# EAGLE design User_Interface_5 (EAGLE 9.2.1)
Daughter board for User Interface
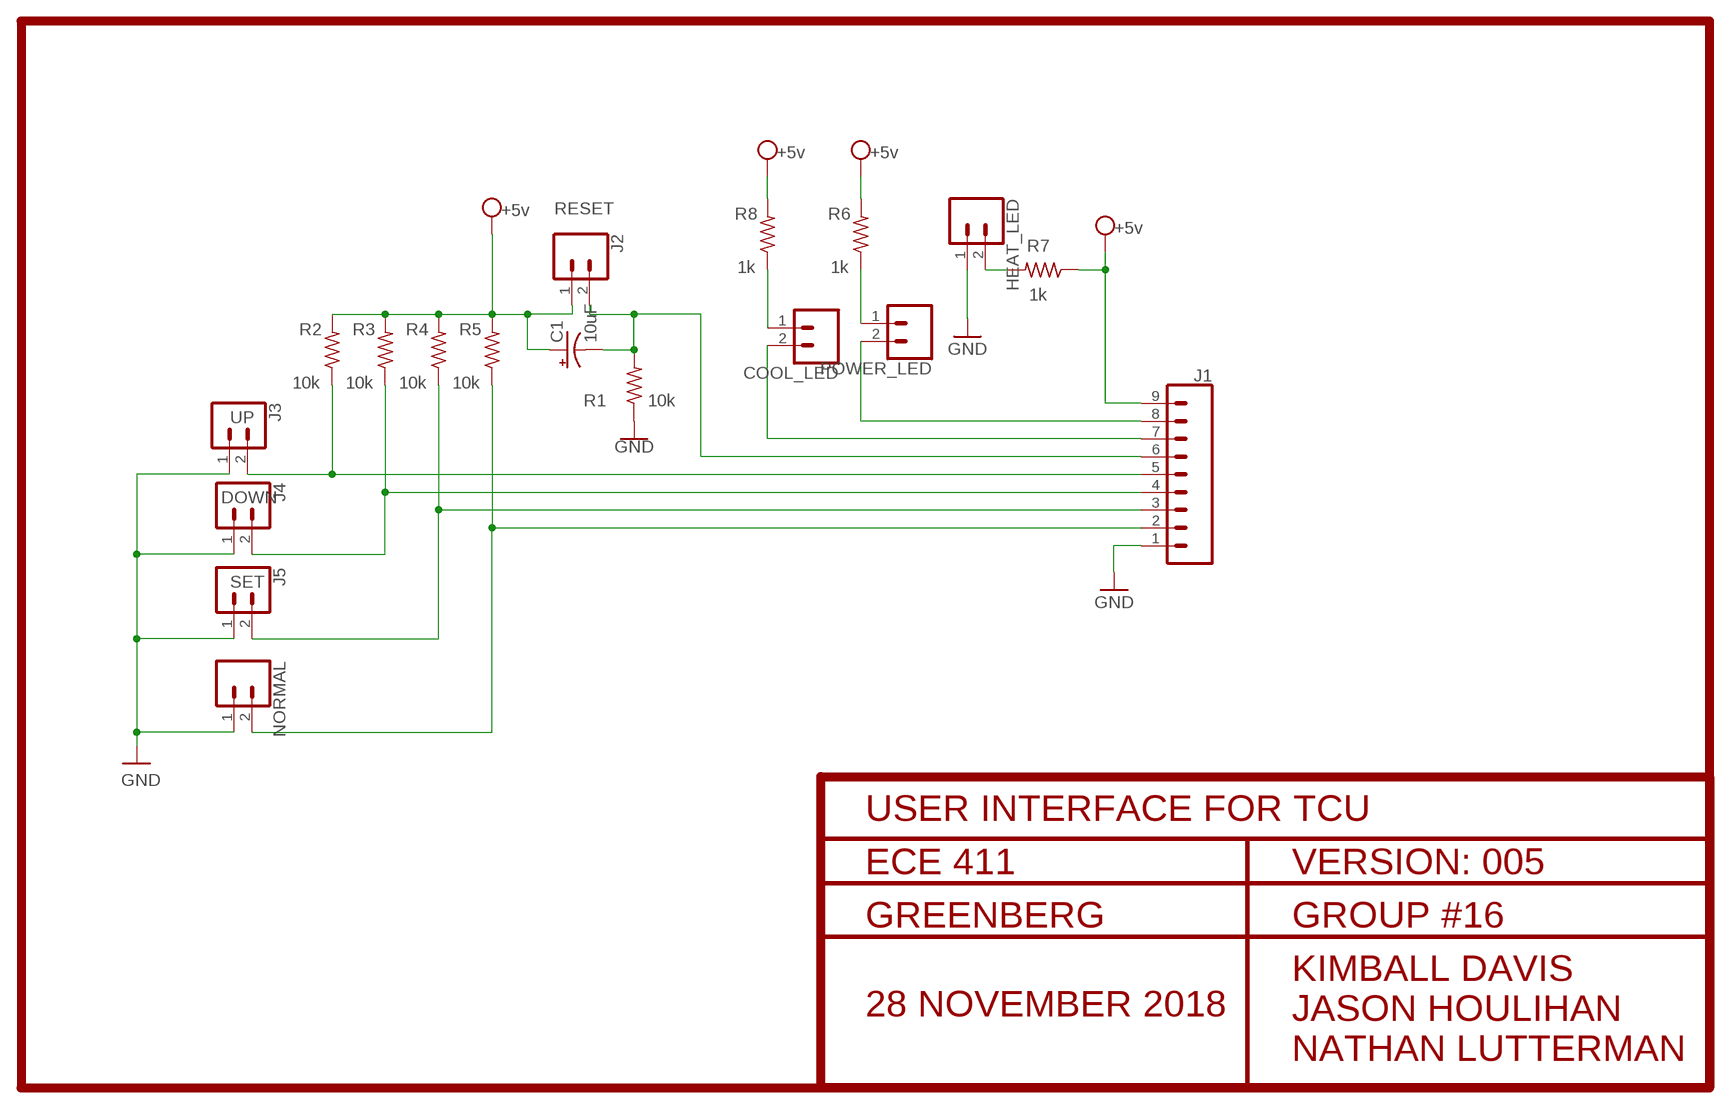
[diagram p0: schematic, sheet 1]

## Parts
C1  10uF  10UF-POLAR-RADIAL-2.5MM-25V-20%  [CPOL-RADIAL-2.5MM-5MM]
COOL_LED  CONN_02  [1X02]
HEAT_LED  CONN_02  [1X02]
J1  CONN_09  [1X09]
J2  RESET  CONN_02  [1X02]
J3  UP  CONN_02  [1X02]
J4  DOWN  CONN_02  [1X02]
J5  SET  CONN_02  [1X02]
NORMAL  CONN_02  [1X02]
POWER_LED  CONN_02  [1X02]
R1  10k  R-US_R0603  [R0603]
R2  10k  R-US_R0603  [R0603]
R3  10k  R-US_R0603  [R0603]
R4  10k  R-US_R0603  [R0603]
R5  10k  R-US_R0603  [R0603]
R6  1k  R-US_R0603  [R0603]
R7  1k  R-US_R0603  [R0603]
R8  1k  R-US_R0603  [R0603]

## Nets
GND: HEAT_LED.1 J1.1 J3.1 J4.1 J5.1 NORMAL.1 R1.1
N$1: COOL_LED.1 R8.1
N$2: J1.8 POWER_LED.2
N$3: COOL_LED.2 J1.7
N$4: J1.5 J3.2 R2.1
N$5: J1.4 J4.2 R3.1
N$6: J1.3 J5.2 R4.1
N$7: J1.2 NORMAL.2 R5.1
N$8: POWER_LED.1 R6.1
N$9: HEAT_LED.2 R7.2
RST: C1.2(-) J1.6 J2.2 R1.2
VCC: C1.1(+) J1.9 J2.1 R2.2 R3.2 R4.2 R5.2 R6.2 R7.1 R8.2 ; supply symbol labelled +5v

## Library data of the parts
C1 = SparkFun-Capacitors:10UF-POLAR: 10.0µF polarized capacitors A capacitor is a passive two-terminal electrical component used to store electrical energy temporarily in an electric field.; PROD_ID: CAP-08440
COOL_LED HEAT_LED J2-J5 NORMAL POWER_LED = SparkFun-Connectors:CONN_02: Multi connection point. Often used as Generic Header-pin footprint for 0.1 inch spaced/style header connections On any of the 0.1 inch spaced packages, you can populate with these: Break Away Headers - Straight <https://www.sparkfun.com/products/116> (PRT-00116) Break Away Male Headers - Right Angle <https://www.sparkfun.com/products/553> (PRT-00553) Female Headers <https://www.sparkfun.com/products/115> (PRT-00115) Break Away Headers - Machine Pin <https://www.sparkfun.com/products/117> (PRT-00117) Break Away Female Headers - Swiss Machine Pin <https://www.sparkfun.com/products/743> (PRT-00743) For SCREWTERMINALS and SPRING TERMINALS visit here: Screw Terimnals on SparkFun.com <https://www.sparkfun.com/search/results?term=Screw+Terminals> (5mm/3.5mm/2.54mm spacing) This device is also useful as a general connection point to wire up your design to another part of your project. Our various solder wires solder well into these plated through hole pads. Hook-Up Wire - Assortment (Stranded, 22 AWG) <https://www.sparkfun.com/products/11375> (PRT-11375) Hook-Up Wire - Assortment (Solid Core, 22 AWG) <https://www.sparkfun.com/products/11367> (PRT-11367) View the entire wire category on our website here <https://www.sparkfun.com/categories/141> Special notes: Molex polarized connector foot print use with: PRT-08233 with associated crimp pins and housings. 2.54_SCREWTERM for use with PRT-10571. 3.5mm Screw Terminal footprints for PRT-08084 5mm Screw Terminal footprints for use with PRT-08432
J1 = SparkFun-Connectors:CONN_09: Multi connection point. Often used as Generic Header-pin footprint for 0.1 inch spaced/style header connections On any of the 0.1 inch spaced packages, you can populate with these: Break Away Headers - Straight <https://www.sparkfun.com/products/116> (PRT-00116) Break Away Male Headers - Right Angle <https://www.sparkfun.com/products/553> (PRT-00553) Female Headers <https://www.sparkfun.com/products/115> (PRT-00115) Break Away Headers - Machine Pin <https://www.sparkfun.com/products/117> (PRT-00117) Break Away Female Headers - Swiss Machine Pin <https://www.sparkfun.com/products/743> (PRT-00743) For SCREWTERMINALS and SPRING TERMINALS visit here: Screw Terimnals on SparkFun.com <https://www.sparkfun.com/search/results?term=Screw+Terminals> (5mm/3.5mm/2.54mm spacing) This device is also useful as a general connection point to wire up your design to another part of your project. Our various solder wires solder well into these plated through hole pads. Hook-Up Wire - Assortment (Stranded, 22 AWG) <https://www.sparkfun.com/products/11375> (PRT-11375) Hook-Up Wire - Assortment (Solid Core, 22 AWG) <https://www.sparkfun.com/products/11367> (PRT-11367) View the entire wire category on our website here <https://www.sparkfun.com/categories/141> Special notes: Molex polarized connector foot print use with SKU : PRT-08231 with associated crimp pins and housings. 1MM SMD Version SKU: PRT-10208 NOTES ON THE VARIANTS LOCK and LOCK_LONGPADS... This footprint was designed to help hold the alignment of a through-hole component (i.e. 6-pin header) while soldering it into place. You may notice that each hole has been shifted either up or down by 0.005 of an inch from it's more standard position (which is a perfectly straight line). This slight alteration caused the pins (the squares in the middle) to touch the edges of the holes. Because they are alternating, it causes a "brace" to hold the component in place. 0.005 has proven to be the perfect amount of "off-center" position when using our standard breakaway headers. Although looks a little odd when you look at the bare footprint, once you have a header in there, the alteration is very hard to notice. Also,if you push a header all the way into place, it is covered up entirely on the bottom side.
R1-R8 = audio amplifier example:R-US_: RESISTOR, American symbol

## Board
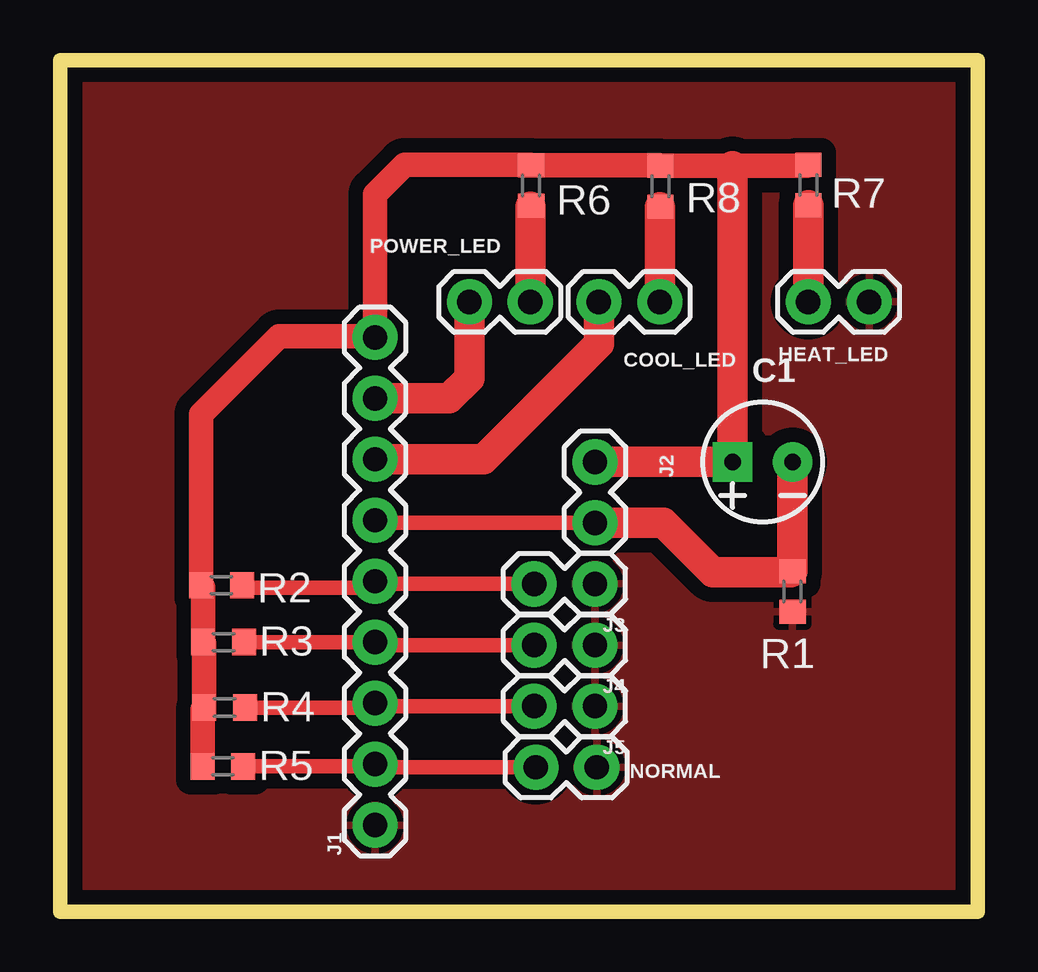
[diagram p1: board, top side]

Size 38.26 x 35.48 mm. Coordinates in mm from the lower left corner, seen from the top.
Outline: 0,35.48 0,0 38.26,0 38.26,35.48 0,35.48
Copper layers (1*16): Top 0.0178mm / dielectric 59mil / Bottom 0.0178mm
Design rules "EPL": minimum track width 8mil, minimum drill 0.35mm, track to track 8mil, track to pad 8mil, pad to pad 8mil, via to via 8mil, smd to smd 8mil, copper to edge 15mil, drill to drill 15mil, minimum pad ring 8mil, minimum via ring 8mil, stop-mask expansion 3mil, vias tented up to drill 0mil, thermal gap 10mil

### Footprints (pad centres in the part's own frame; a part is rotated, then mirrored left to right if it is on the bottom)
CPOL-RADIAL-2.5MM-5MM = drill 0.7 pad 1.651 square: 1 1.25,0 | drill 0.7 pad 1.651: 2 -1.25,0
1X02 = drill 1.016 pad 1.88: 1 0,0; 2 2.54,0
1X09 = drill 1.016 pad 1.88: 1 0,0; 2 2.54,0; 3 5.08,0; 4 7.62,0; 5 10.16,0; 6 12.7,0; 7 15.24,0; 8 17.78,0; 9 20.32,0
R0603 = smd 1 x 1.1: 1 -0.85,0; 2 0.85,0

### Placement (x,y rotation side)
C1  29.29,18.73 180 top
COOL_LED  25,25.4 180 top
HEAT_LED  33.73,25.4 180 top
J1  13.13,3.6 90 top
J2  22.3,18.73 270 top
J3  22.3,13.65 180 top
J4  22.3,11.1 180 top
J5  22.3,8.56 180 top
NORMAL  22.38,6.01 180 top
POWER_LED  19.61,25.4 180 top
R1  30.53,13.34 90 top
R2  6.73,13.59 180 top
R3  6.82,11.23 180 top
R4  6.87,8.5 180 top
R5  6.79,6.05 180 top
R6  19.64,30.25 90 top
R7  31.2,30.27 270 top
R8  25.03,30.22 90 top

### Tracks (layer width: path | path; a pad name or v marks a point on that pad's centre or on a via)
GND
  pour Top (isolate 0.61): -2.14,39.21 41.2,39.21 41.2,-3.65 -2.14,-3.65
N$1
  Top 0.61: R8.1 25,29.34
  Top 1.27: 25,29.34 COOL_LED.1
N$2
  Top 1.27: J1.8 16.22,21.38 17.07,22.23 POWER_LED.2
N$3
  Top 1.27: J1.7 17.65,18.84 22.46,23.65 COOL_LED.2
N$4
  Top 0.61: 13.4,13.49 J1.5 | R2.1 7.68,13.49 13.4,13.49 | J3.2 13.56,13.65 13.4,13.49
N$5
  Top 0.61: R3.1 J1.4 13.25,11.1 J4.2
N$6
  Top 0.61: J1.3 13.32,8.5 12.94,8.5 | R4.1 12.94,8.5 | 12.94,8.5 13.01,8.57 13.03,8.56 J5.2
N$7
  Top 0.61: R5.1 13.04,6.05 | 13.04,6.05 J1.2 | NORMAL.2 13.07,6.01 13.04,6.05
N$8
  Top 0.61: 19.61,29.37 R6.1
  Top 1.27: POWER_LED.1 19.61,29.37
N$9
  Top 0.61: HEAT_LED.2
  Top 1.27: HEAT_LED.2 R7.2
RST
  Top 0.61: J2.2 13.25,16.19 J1.6
  Top 1.016: C1.2 | 30.48,14.13 R1.2
  Top 1.27: R1.2 C1.2 | J2.2 25.16,16.19 27.23,14.13 30.48,14.13
VCC
  Top 1.016: R5.2 5.94,8.42 R4.2 6.02,11.18 R3.2 5.97,13.51 R2.2 5.88,20.73 9.13,23.97 13.09,23.97 J1.9 13.13,29.88 14.37,31.12 19.62,31.12 R6.2 25,31.1 R8.2 28.02,31.07 | 28.02,31.07 31.14,31.07 R7.1 | 28.04,31.05 28.02,31.07
  Top 1.27: 28.04,31.05 C1.1 J2.1

### Text on the board
tValues: ECE 411 / Group #16 / User Interface / Version #005 / 28 November 2018